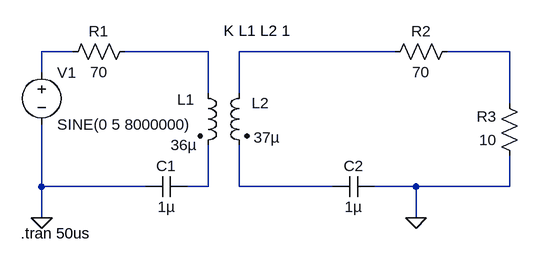
[diagram p0: schematic wireless circuit simulation.asc]
wireless circuit simulation.asc, the LTspice schematic file:
Version 4
SHEET 1 880 680
WIRE 48 80 0 80
WIRE 256 80 128 80
WIRE 544 80 304 80
WIRE 720 80 624 80
WIRE 0 112 0 80
WIRE 256 144 256 80
WIRE 304 144 304 80
WIRE 720 160 720 80
WIRE 0 288 0 192
WIRE 160 288 0 288
WIRE 256 288 256 224
WIRE 256 288 224 288
WIRE 304 288 304 224
WIRE 448 288 304 288
WIRE 576 288 512 288
WIRE 720 288 720 240
WIRE 720 288 576 288
WIRE 0 336 0 288
WIRE 576 336 576 288
FLAG 0 336 0
FLAG 576 336 0
SYMBOL voltage 0 96 R0
WINDOW 123 0 0 Left 0
WINDOW 39 0 0 Left 0
SYMATTR InstName V1
SYMATTR Value SINE(0 5 8000000)
SYMBOL cap 224 272 R90
WINDOW 0 0 32 VBottom 2
WINDOW 3 32 32 VTop 2
SYMATTR InstName C1
SYMATTR Value 1µ
SYMBOL cap 512 272 R90
WINDOW 0 0 32 VBottom 2
WINDOW 3 32 32 VTop 2
SYMATTR InstName C2
SYMATTR Value 1µ
SYMBOL res 144 64 R90
WINDOW 0 0 56 VBottom 2
WINDOW 3 32 56 VTop 2
SYMATTR InstName R1
SYMATTR Value 70
SYMBOL res 640 64 R90
WINDOW 0 0 56 VBottom 2
WINDOW 3 32 56 VTop 2
SYMATTR InstName R2
SYMATTR Value 70
SYMBOL res 736 256 R180
WINDOW 0 36 76 Left 2
WINDOW 3 36 40 Left 2
SYMATTR InstName R3
SYMATTR Value 10
SYMBOL ind2 240 128 R0
WINDOW 0 -31 26 Left 2
WINDOW 3 -41 96 Left 2
SYMATTR InstName L1
SYMATTR Value 36µ
SYMATTR Type ind
SYMBOL ind2 320 128 M0
WINDOW 0 -30 31 Left 2
WINDOW 3 -47 84 Left 2
SYMATTR InstName L2
SYMATTR Value 37µ
SYMATTR Type ind
TEXT 280 48 Left 2 !K L1 L2 1
TEXT -32 360 Left 2 !.tran 50us

The netlist it stands for:
* wireless circuit simulation.asc
V1 N001 0 SINE(0 5 8000000)
C1 N005 0 1µ
C2 0 N006 1µ
R1 N002 N001 70
R2 N004 N003 70
R3 0 N004 10
L1 N002 N005 36µ
L2 N003 N006 37µ
K L1 L2 1
.tran 50us
.backanno
.end